# Altium project STM32F746 DEV BOARD_V1I1.PrjPcb (part 2 of 2)

## Sheet [11] - LCD.SchDoc
size A3; DocumentNumber: 11; SheetNumber: 11; SheetTotal: 18
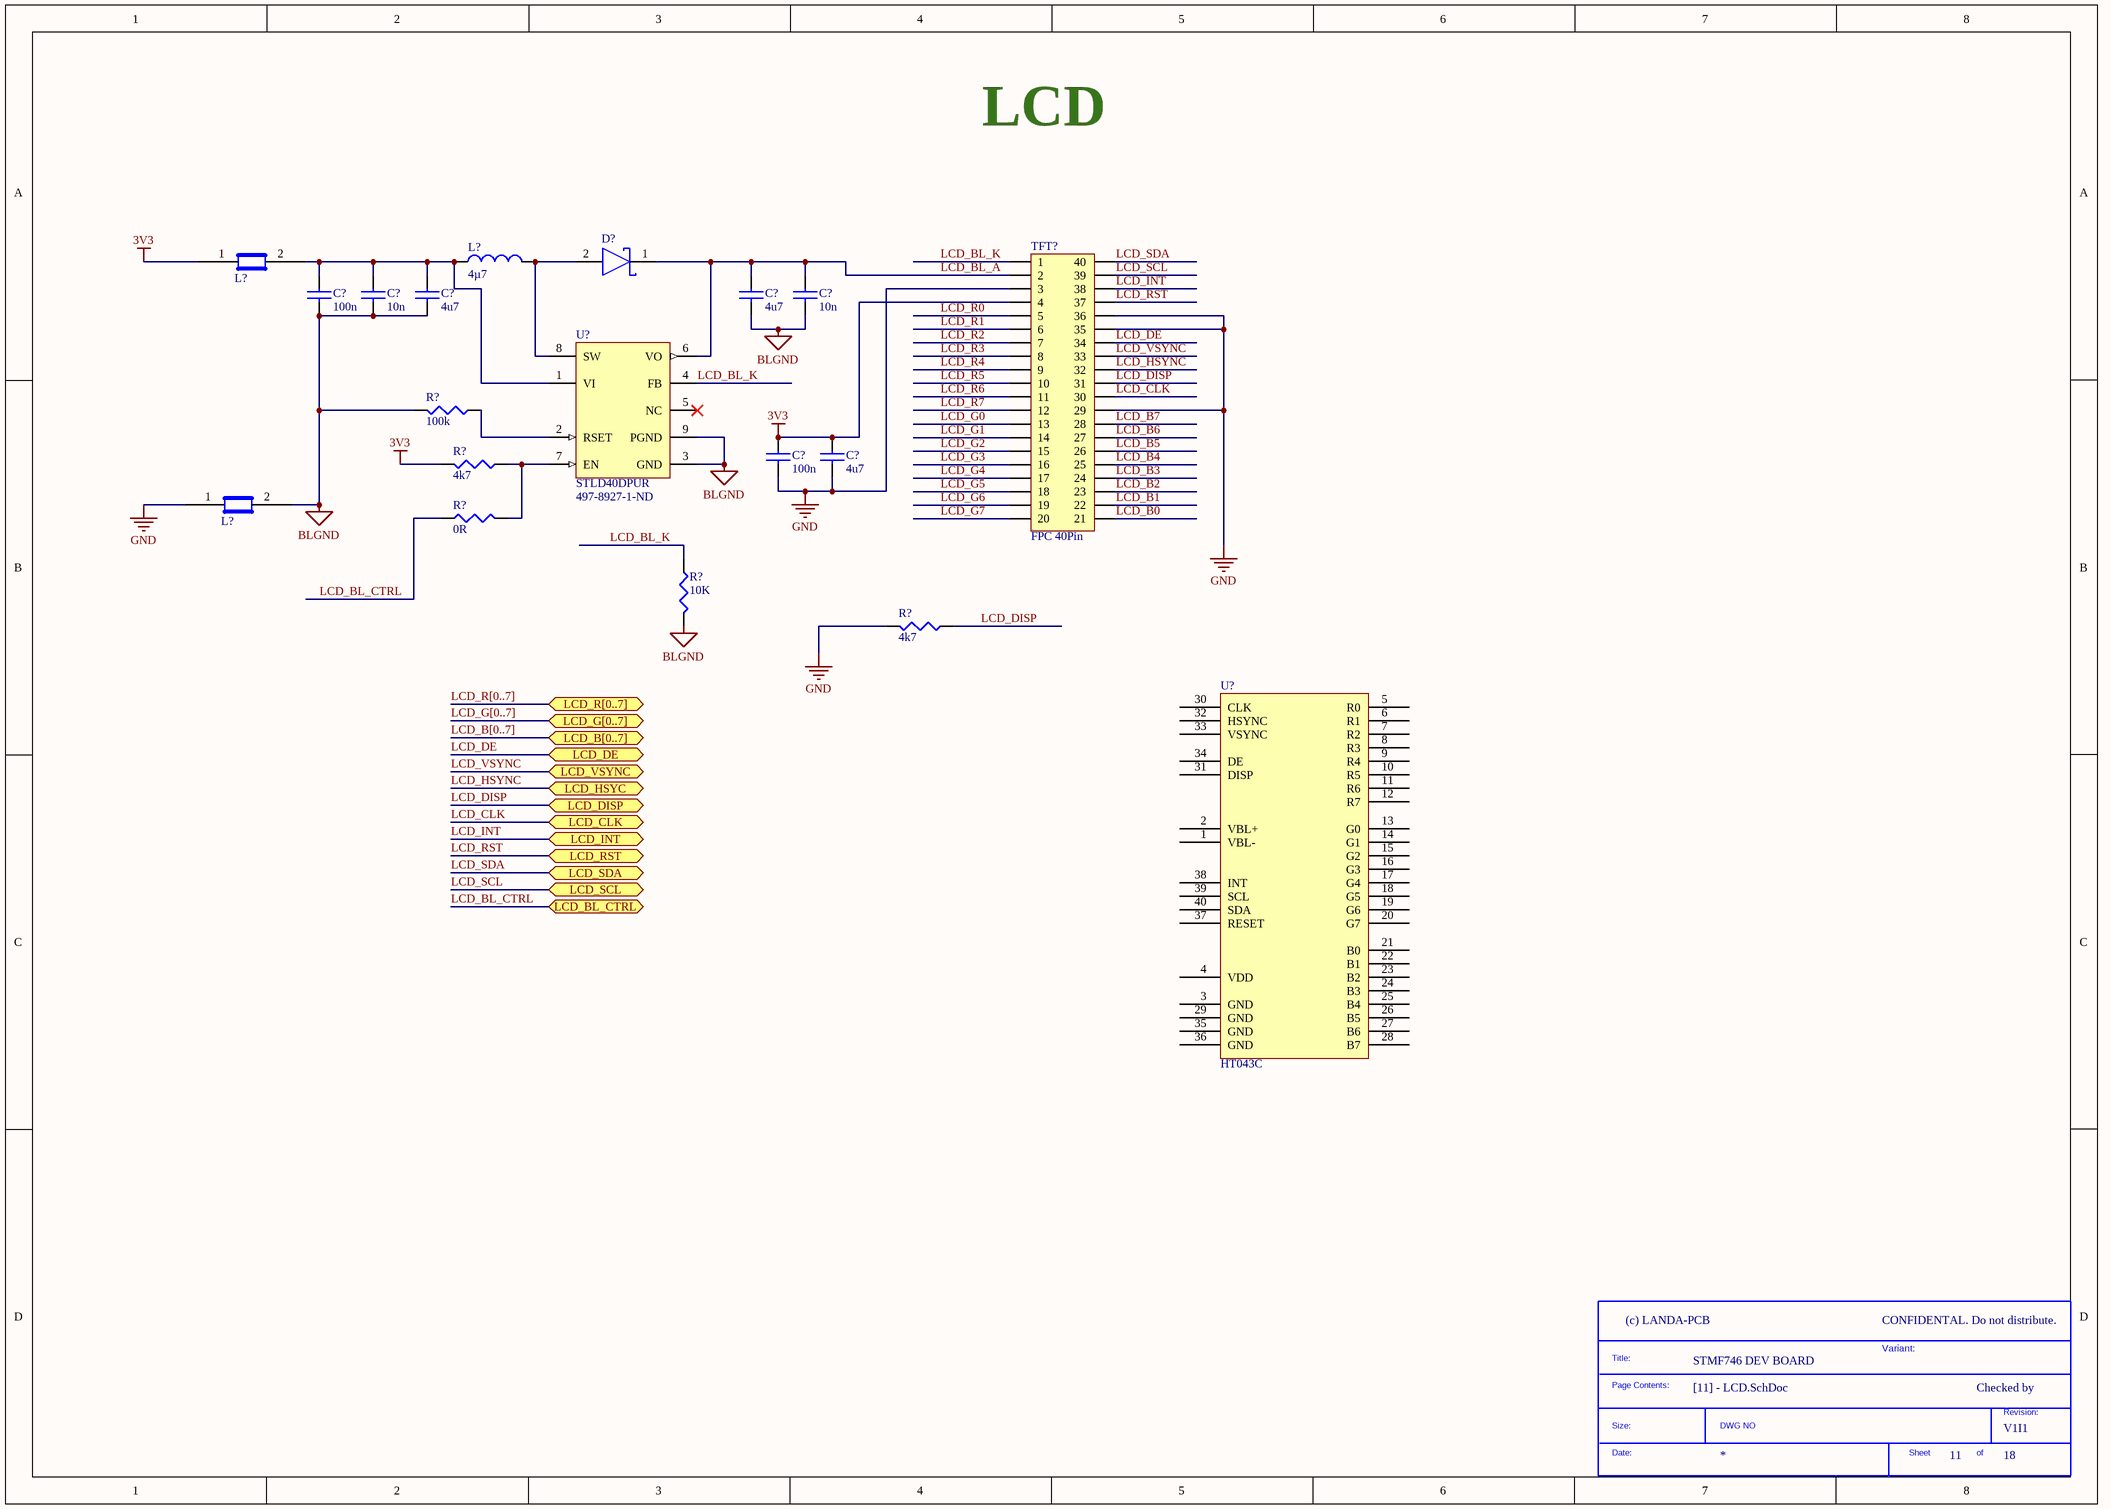
[diagram p13: [11] - LCD.SchDoc]

### Parts
(Parts that share a designator on the sheet are numbered #1, #2 ... from top to bottom, then left to right.)
*#14  SDTitleBlock  (value not drawn)  (graphical)
C?#84  100n  [C0402]
C?#85  10n  [C0402]
C?#86  4u7  [C0402]
C?#87  4u7  [C0402]
C?#88  10n  [C0402]
C?#89  100n  [C0402]
C?#90  4u7  [C0402]
D?#2  STPS1L40M  [STPS1L40M]  (value not drawn)
L?#5  MPZ1608S601A 600OHM/1A  [C0603]  (value not drawn)
L?#6  4µ7  [IHLP_255MILx270MIL]
L?#7  MPZ1608S601A 600OHM/1A  [C0603]  (value not drawn)
R?#98  100k  [R0402]
R?#99  4k7  [R0402]
R?#100  0R  [R0402]
R?#101  10K  [R0402]
R?#102  4k7  [R0402]
TFT?  FPC 40Pin  [FPC_40Pin]
U?#13  STLD40DPUR  Supplier Part Number 1: 497-8927-1-ND  [QFN8_V]
U?#14  HT043C  [LCD_Kunjian_ HT043C_40P_P080_FLEX_FOLDED]

### Ports
LCD_B[0..7] (bidir), LCD_BL_CTRL (bidir), LCD_CLK (bidir), LCD_DE (bidir), LCD_DISP (bidir), LCD_G[0..7] (bidir), LCD_HSYC (bidir), LCD_INT (bidir), LCD_R[0..7] (bidir), LCD_RST (bidir), LCD_SCL (bidir), LCD_SDA (bidir), LCD_VSYNC (bidir)

### Nets
3V3: C?#89.1 C?#90.1 L?#5.1 R?#99.2 TFT?.4  [project net 3V3_uSD]
BLGND: C?#84.2 C?#85.2 C?#86.2 C?#87.2 C?#88.2 L?#7.2 R?#98.2 R?#101.2 U?#13.3(GND) U?#13.9(PGND)
GND: C?#89.2 C?#90.2 L?#7.1 R?#102.2 TFT?.3 TFT?.29 TFT?.35 TFT?.36
LCD_B0: TFT?.21
LCD_B1: TFT?.22
LCD_B2: TFT?.23
LCD_B3: TFT?.24
LCD_B4: TFT?.25
LCD_B5: TFT?.26
LCD_B6: TFT?.27
LCD_B7: TFT?.28
LCD_BL_A: C?#87.1 C?#88.1 D?#2.1(K) TFT?.2 U?#13.6(VO)
LCD_BL_CTRL: R?#100.1 ; port LCD_BL_CTRL
LCD_BL_K: R?#101.1 TFT?.1 U?#13.4(FB)
LCD_CLK: TFT?.30 ; port LCD_CLK
LCD_DE: TFT?.34 ; port LCD_DE
LCD_DISP: R?#102.1 TFT?.31 ; port LCD_DISP
LCD_G0: TFT?.13
LCD_G1: TFT?.14
LCD_G2: TFT?.15
LCD_G3: TFT?.16
LCD_G4: TFT?.17
LCD_G5: TFT?.18
LCD_G6: TFT?.19
LCD_G7: TFT?.20
LCD_HSYNC: TFT?.32 ; port LCD_HSYC
LCD_INT: TFT?.38 ; port LCD_INT
LCD_R0: TFT?.5
LCD_R1: TFT?.6
LCD_R2: TFT?.7
LCD_R3: TFT?.8
LCD_R4: TFT?.9
LCD_R5: TFT?.10
LCD_R6: TFT?.11
LCD_R7: TFT?.12
LCD_RST: TFT?.37 ; port LCD_RST
LCD_SCL: TFT?.39 ; port LCD_SCL
LCD_SDA: TFT?.40 ; port LCD_SDA
LCD_VSYNC: TFT?.33 ; port LCD_VSYNC
NetC?#84_1: C?#84.1 C?#85.1 C?#86.1 L?#5.2 L?#6.1 U?#13.1(VI)
NetD?#2_2: D?#2.2(A) L?#6.2 U?#13.8(SW)
NetR?#98_1: R?#98.1 U?#13.2(RSET)
NetR?#99_1: R?#99.1 R?#100.2 U?#13.7(EN)

Not connected (* = marked no-connect by the designer): U?#13 5(NC)*; U?#14 1(VBL-) 2(VBL+) 3(GND) 4(VDD) 5(R0) 6(R1) 7(R2) 8(R3) 9(R4) 10(R5) 11(R6) 12(R7) 13(G0) 14(G1) 15(G2) 16(G3) 17(G4) 18(G5) 19(G6) 20(G7) 21(B0) 22(B1) 23(B2) 24(B3) 25(B4) 26(B5) 27(B6) 28(B7) 29(GND) 30(CLK) 31(DISP) 32(HSYNC) 33(VSYNC) 34(DE) 35(GND) 36(GND) 37(RESET) 38(INT) 39(SCL) 40(SDA)

### Buses and harness runs
bus LCD_B[0..7] = port LCD_B[0..7]
bus LCD_G[0..7] = port LCD_G[0..7]
bus LCD_R[0..7] = port LCD_R[0..7]

### Notes on the sheet
- LCD
- CONFIDENTAL. Do not distribute.
- CLOCKS (CPU & PCIE)
- Variant:
- Checked by
- (in symbol SDTitleBlock) Title:; Page Contents:; Revision:; Size:; DWG NO; Date:; Sheet; of

### Library data of the parts
C?#84 C?#89 = C1005X5R1H104K: CAP CER .10UF 50V X5R 10% 0402; Manufacturer: TDK Corporation; Capacitance: 0.1µF; Value: 100nF; .Checked PCB: used; Category: Capacitors; Supplier Part Number: 445-5942-1-ND; Manufacturer Part Number: C1005X5R1H104K; Operating Temperature: -55°C ~ 85°C; Package / Case: 0402 (1005 Metric); Price 1k [$]: 0.02340; .Checked SCH: used; Voltage - Rated: 50V; Supplier: Digikey; Supplier 1: Digi-Key; Supplier Part Number 1: 445-5942-1-ND; RoHS: RoHS Compliant; Stock 1: 106926; Pricing 1: 1=0.27, 10=0.18, 100=0.072, 250=0.05176, 500=0.0369, 1000=0.027 (USD); Tolerance: ±10%; Temperature Coefficient: X5R; Mounting Type: Surface Mount, MLCC; Applications: General Purpose; Ratings: -; Size / Dimension: 0.039" L x 0.020" W (1.00mm x 0.50mm); Height - Seated (Max): -; Thickness (Max): 0.022" (0.55mm); Lead Spacing: -; Features: -; Packaging: Cut Tape (CT); Lead Style: -; ComponentLink1URL: http://www.tdk.co.jp/tefe02/e412_c.pdf; ComponentLink1Description: http://www.tdk.co.jp/tefe02/e412_c.pdf
C?#85 C?#88 = C1005X7R1C103K: CAP CER 10000PF 16V X7R 10% 0402; Manufacturer: TDK Corporation; Value: 10nF; .Checked PCB: used; Capacitance: 10000pF; Category: Capacitors; Manufacturer Part Number: C1005X7R1C103K; Operating Temperature: -55°C ~ 125°C; Package / Case: 0402 (1005 Metric); Price 1k [$]: 0.00416; .Checked SCH: used; Voltage - Rated: 16V; Supplier Part Number: 445-1262-1-ND; Supplier: Digikey; Supplier 1: Digi-Key; Supplier Part Number 1: 445-1262-1-ND; RoHS: RoHS Compliant; Stock 1: 511497; Pricing 1: 1=0.08, 10=0.05, 100=0.018, 250=0.013, 500=0.0096, 1000=0.0065 (USD); Tolerance: ±10%; Temperature Coefficient: X7R; Mounting Type: Surface Mount, MLCC; Applications: General Purpose; Ratings: -; Size / Dimension: 0.039" L x 0.020" W (1.00mm x 0.50mm); Height - Seated (Max): -; Thickness (Max): 0.022" (0.55mm); Lead Spacing: -; Features: -; Packaging: Cut Tape (CT); Lead Style: -; ComponentLink1URL: http://www.tdk.co.jp/tefe02/e412_c.pdf; ComponentLink1Description: http://www.tdk.co.jp/tefe02/e412_c.pdf
C?#86 C?#87 C?#90 = C1005X5R1A475M: CAP CER 4.7UF 10V 20% X5R 0402; Manufacturer: TDK Corporation; Capacitance: 4.7µF; .Checked PCB: RF; Supplier 1: Digi-Key; Supplier Part Number 1: 445-8023-1-ND; Manufacturer Part Number: C1005X5R1A475M; RoHS: RoHS Compliant; Category: Capacitors; Stock 1: 10140; Pricing 1: 1=0.53, 10=0.415, 100=0.25, 250=0.18752, 500=0.16, 1000=0.125, 5000=0.095 (USD); Voltage - Rated: 10V; Tolerance: ±20%; Temperature Coefficient: X5R; Mounting Type: Surface Mount, MLCC; Operating Temperature: -55°C ~ 85°C; Applications: General Purpose; Ratings: -; Package / Case: 0402 (1005 Metric); Size / Dimension: 0.039" L x 0.020" W (1.00mm x 0.50mm); Height - Seated (Max): -; Thickness (Max): -; Lead Spacing: -; Features: -; Packaging: Cut Tape (CT); Lead Style: -; ComponentLink1URL: http://www.tdk.com/pdf/general_B11.pdf; ComponentLink1Description: http://www.tdk.com/pdf/general_B11.pdf; .Checked SCH: RF
L?#5 L?#7 = MPZ1608S601A: FERRITE CHIP BEAD 600 OHM SMD 1A; Manufacturer: TDK Corporation; Impedance @ Frequency: 600 Ohm @ 100MHz; DC Resistance (DCR): 150 mOhm Max; Filter Type: Differential Mode - Single; Number of Lines: 1; .Checked PCB: RF; Supplier 1: Digi-Key; Supplier Part Number 1: 445-2205-1-ND; Manufacturer Part Number: MPZ1608S601A; RoHS: RoHS Compliant; Category: Filters; Stock 1: 328345; Pricing 1: 1=0.36, 10=0.24, 100=0.096, 250=0.069, 500=0.0492, 1000=0.036 (USD); Current Rating: 1A; Package / Case: 0603 (1608 Metric); Mounting Type: Surface Mount; Packaging: Cut Tape (CT); Height (Max): 0.037" (0.95mm); Size / Dimension: 0.063" L x 0.031" W (1.60mm x 0.80mm); ComponentLink1URL: http://www.tdk.co.jp/tefe02/e9413_mpz.pdf; ComponentLink1Description: http://www.tdk.co.jp/tefe02/e9413_mpz.pdf; .Checked SCH: RF
L?#6 = IHLP2525CZER4R7M01: INDUCTOR POWER 4.7UH 5.5A SMD; Manufacturer: Vishay/Dale; .Checked PCB: used; Inductance: 4.7µH; Current - Saturation: 10A; Shielding: Shielded; DC Resistance (DCR): 40 mOhm Max; Tolerance: ±20%; Frequency - Test: 100kHz; .Checked SCH: used; Category: Inductors, Coils, Chokes; Manufacturer Part Number: IHLP2525CZER4R7M01; Operating Temperature: -55°C ~ 125°C; Package / Case: 0.270" L x 0.255" W x 0.118" H (6.86mm x 6.47mm x 3.00mm); Price 1k [$]: 1.09800; Value: 4µ7; Current: 5.5A; Applications: General Purpose; Supplier Part Number: 541-1010-1-ND; Supplier: Digikey; Supplier 1: Digi-Key; Supplier Part Number 1: 541-1010-1-ND; RoHS: RoHS Compliant; Stock 1: 25684; Pricing 1: 1=2.26, 10=1.83, 100=1.525, 500=1.22, 1000=1.098 (USD); Current - Temperature Rise: 5.5A; Type: -; Q @ Freq: -; Frequency - Self Resonant: -; Material - Core: -; Mounting Type: Surface Mount; Packaging: Cut Tape (CT); ComponentLink1URL: http://www.vishay.com/doc?34104; ComponentLink1Description: http://www.vishay.com/doc?34104
R?#98 R?#99 R?#102 = RC0402FR-0710KL: RES 10.0K OHM 1/16W 1% 0402 SMD; Manufacturer: Yageo; Resistance (Ohms): 10K; Power (Watts): 0.063W, 1/16W; Value: 10k; .Checked PCB: used; Temperature Coefficient: ±100ppm/°C; Category: Resistors; Supplier Part Number: 311-10.0KLRCT-ND; Manufacturer Part Number: RC0402FR-0710KL; Package / Case: 0402 (1005 Metric); Price 1k [$]: 0.01421; Tolerance: ±1%; .Checked SCH: used; Supplier: Digikey; Supplier 1: Digi-Key; Supplier Part Number 1: 311-10.0KLRCT-ND; RoHS: RoHS Compliant; Stock 1: 2916495; Pricing 1: 10=0.014, 50=0.0104, 100=0.0079, 250=0.00584, 500=0.00432, 1000=0.00288 (USD); Composition: Thick Film; Features: -; Size / Dimension: 0.039" L x 0.020" W (1.00mm x 0.50mm); Height: 0.016" (0.40mm); Number of Terminations: 2; Packaging: Cut Tape (CT); ComponentLink1URL: http://www.yageo.com/documents/recent/PYu-RC0402_51_RoHS_L_6.pdf; ComponentLink1Description: http://www.yageo.com/documents/recent/PYu-RC0402_51_RoHS_L_6.pdf
R?#100 = CRCW0402330RFKED: RES 330 OHM 1/16W 1% 0402 SMD; Manufacturer: Vishay Dale; Resistance (Ohms): 330; Power (Watts): 0.063W, 1/16W; Temperature Coefficient: ±100ppm/°C; .Checked PCB: RF; Supplier 1: Digi-Key; Supplier Part Number 1: 541-330LCT-ND; Manufacturer Part Number: CRCW0402330RFKED; RoHS: RoHS Compliant; Category: Resistors; Stock 1: 49303; Pricing 1: 10=0.083, 50=0.0444, 200=0.0255, 1000=0.0174 (USD); Composition: Thick Film; Features: -; Tolerance: ±1%; Package / Case: 0402 (1005 Metric); Size / Dimension: 0.039" L x 0.020" W (1.00mm x 0.50mm); Height: 0.016" (0.40mm); Number of Terminations: 2; Packaging: Cut Tape (CT); ComponentLink1URL: http://www.vishay.com/doc?20035; ComponentLink1Description: http://www.vishay.com/doc?20035; .Checked SCH: RF
R?#101 = RC0402FR-07100RL: RES 100 OHM 1/16W 1% 0402 SMD; Manufacturer: Yageo; Resistance (Ohms): 100; Power (Watts): 0.063W, 1/16W; Value: 100R; .Checked PCB: RF; Temperature Coefficient: ±100ppm/°C; Category: Resistors; Supplier Part Number: 311-100LRCT-ND; Manufacturer Part Number: RC0402FR-07100RL; Package / Case: 0402 (1005 Metric); Price 1k [$]: 0.01421; Tolerance: ±1%; .Checked SCH: RF; Supplier: Digikey; Supplier 1: Digi-Key; Supplier Part Number 1: 311-100LRCT-ND; RoHS: RoHS Compliant; Stock 1: 1682040; Pricing 1: 10=0.014, 50=0.0104, 100=0.0079, 250=0.00584, 500=0.00432, 1000=0.00288 (USD); Composition: Thick Film; Features: -; Size / Dimension: 0.039" L x 0.020" W (1.00mm x 0.50mm); Height: 0.016" (0.40mm); Number of Terminations: 2; Packaging: Cut Tape (CT); ComponentLink1URL: http://www.yageo.com/documents/recent/PYu-RC0402_51_RoHS_L_6.pdf; ComponentLink1Description: http://www.yageo.com/documents/recent/PYu-RC0402_51_RoHS_L_6.pdf
TFT? = FPC_40Pin: DISIGNER: ARMAN ARVAND
U?#13 = STLD40DPUR: White Led Power Supply For Large Display Backlight, 8-Pin VFDFPN, Tape and Reel; ComponentLink1Description: Manufacturer URL; ComponentLink2Description: Datasheet; DatasheetVersion: May-2011; ComponentLink1URL: http://www.st.com; PackageVersion: 2011; PackageDescription: 8-Pin Dual Flat No-Lead, 3 x 3 mm Body, 0.65 mm Pitch, Exposed Pad; ComponentLink2URL: http://www.st.com/internet/com/TECHNICAL_RESOURCES/TECHNICAL_LITERATURE/DATASHEET/CD00098098.pdf; PackageReference: QFN8; PartNumber: STLD40DPUR; Supplier 1: Digi-Key
U?#14 = HT043C: 4.3 inch TFT 480*272 pixels with LED Backlight and Capacitive touch panel, high luminance; Manuf_1: KUNJIAN; ECCN_US/EU: EAR99/NEC; Manuf_Part_1: HT043C; Distrib: Sub Co; Ref St: *
D?#2 = STPS1L40M: Supplier 1: Digi-Key; Supplier Part Number 1: 497-3212-1-ND

## Sheet [12] - CAN.SchDoc
size A3; DocumentNumber: 12; SheetNumber: 12; SheetTotal: 18
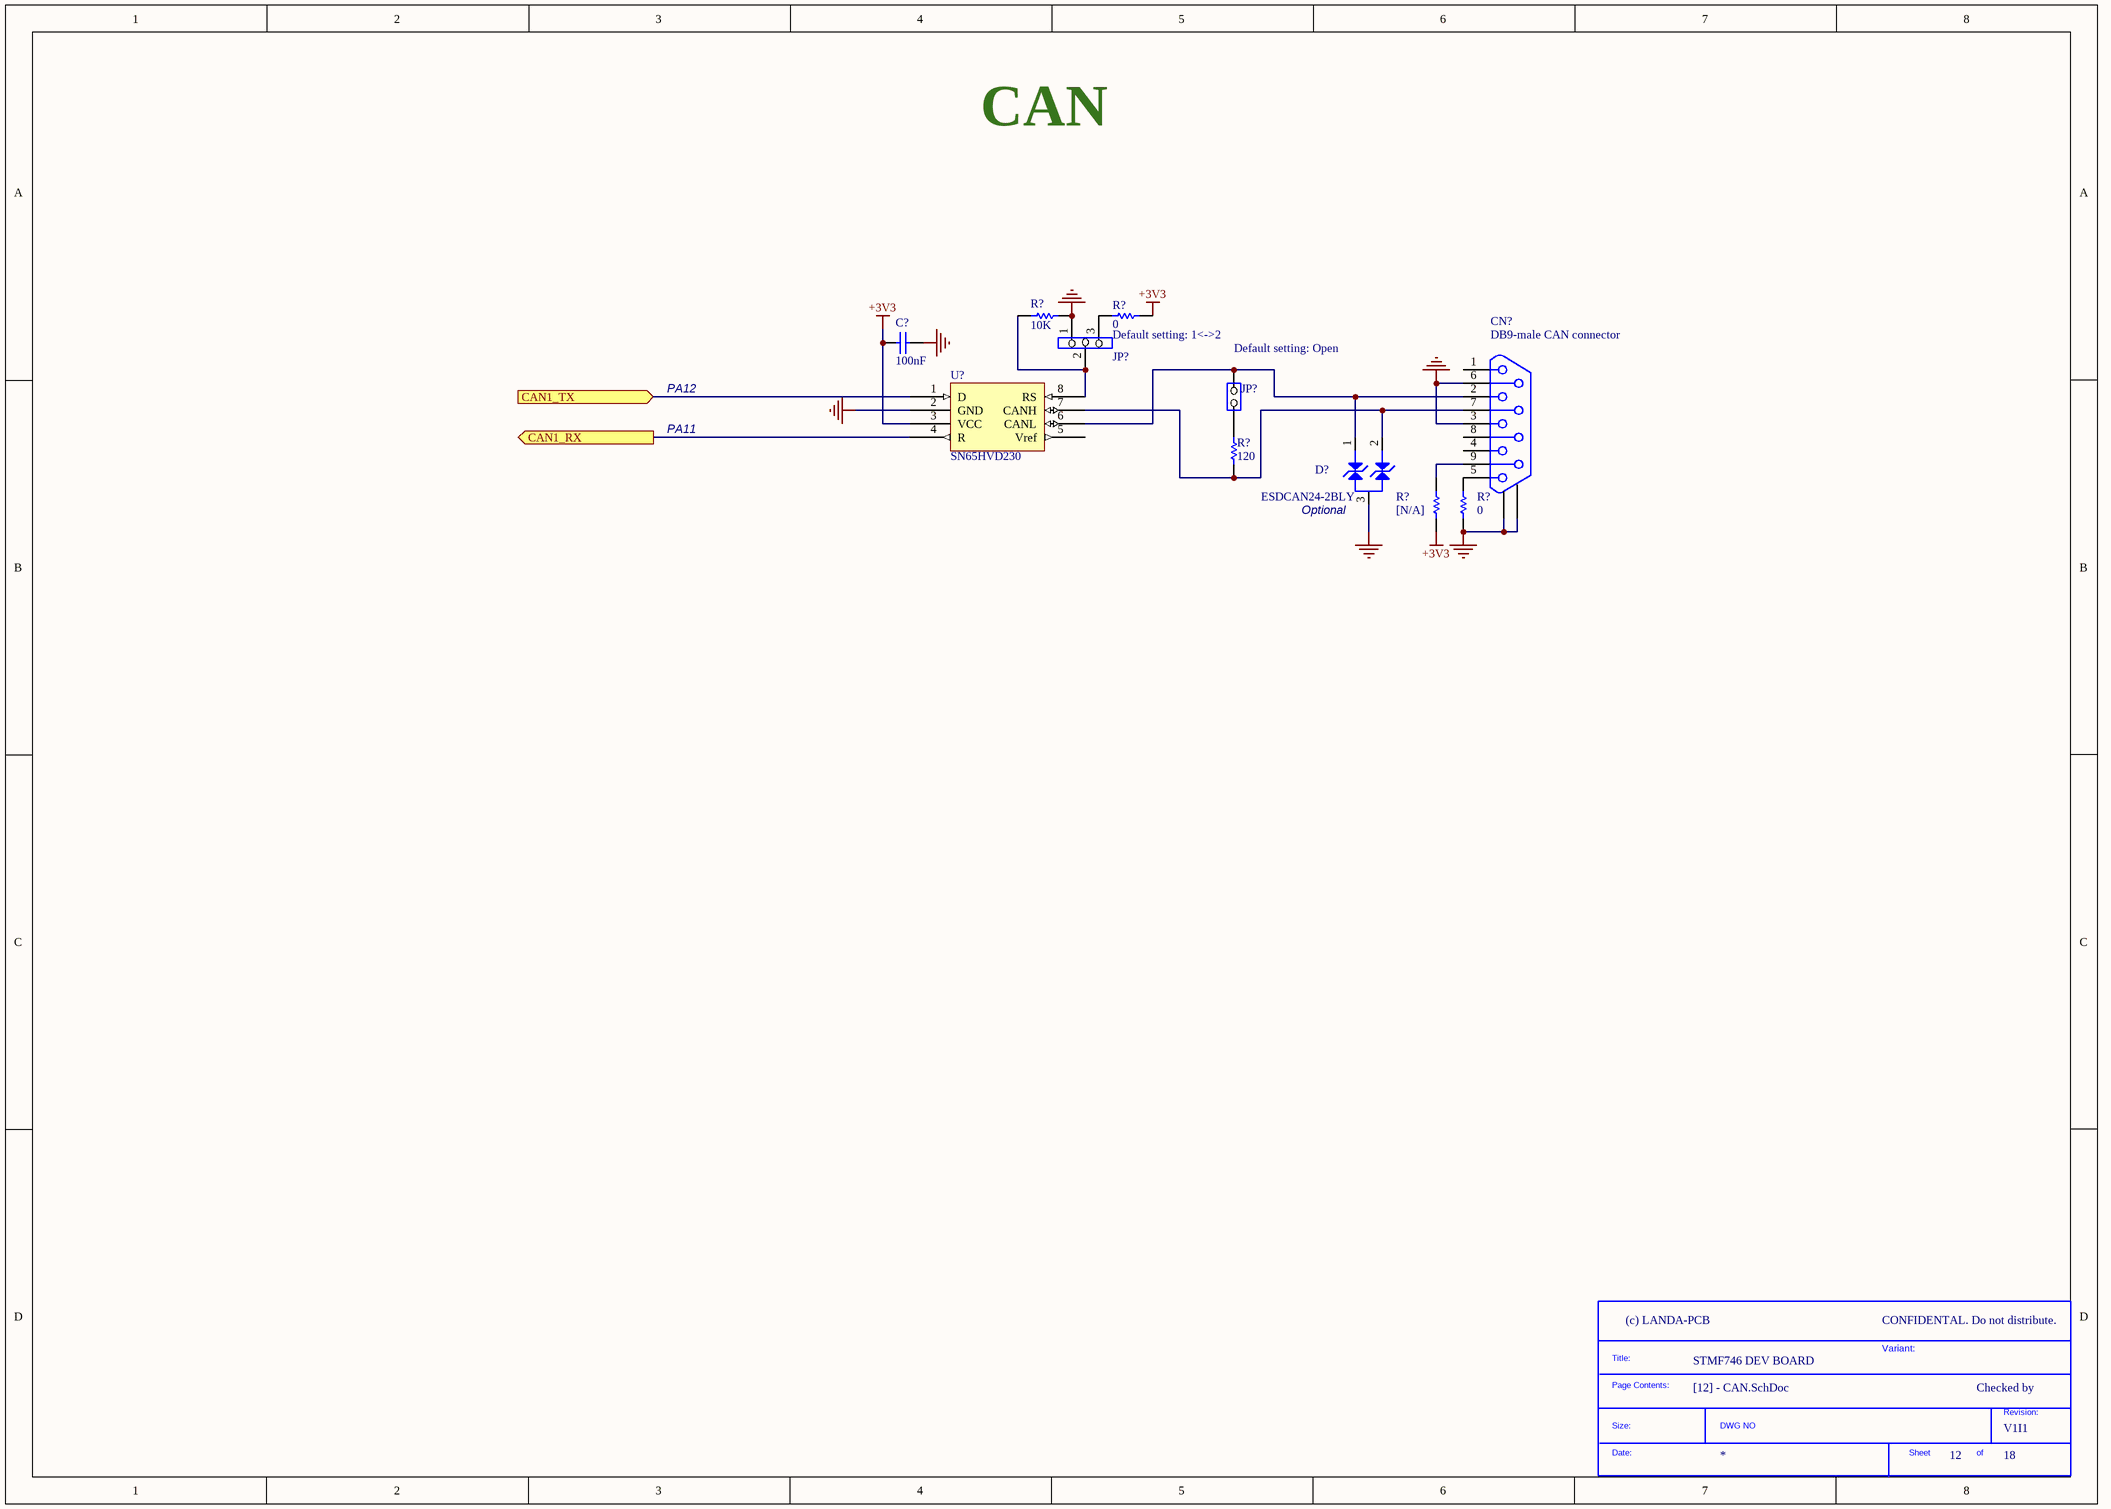
[diagram p14: [12] - CAN.SchDoc]

### Parts
(Parts that share a designator on the sheet are numbered #1, #2 ... from top to bottom, then left to right.)
*#15  SDTitleBlock  (value not drawn)  (graphical)
C?#91  100nF  [0603C]
CN?#8  DB9-male CAN connector  [DB9/M]
D?#3  ESDCAN24-2BLY  [SOT-23]
JP?#2  (no value)  [SIP3]
JP?#3  (no value)  [SIP2]
R?#103  10K  [0603R]
R?#104  0  [0603R]
R?#105  120  [0603R]
R?#106  [N/A]  [0603R]
R?#107  0  [0603R]
U?#15  SN65HVD230  [SOIC8_1R27_4R9X6]

### Ports
CAN1_RX (out), CAN1_TX (in)

### Nets
+3V3: C?#91.1 R?#104.2 R?#106.1 U?#15.3(VCC)
GND: C?#91.2 CN?#8.3 CN?#8.6 CN?#8.10 CN?#8.11 D?#3.3 JP?#2.1 R?#103.2 R?#107.1 U?#15.2(GND)
NetCN?#8_2: CN?#8.2 D?#3.1 JP?#3.2(NO) U?#15.6(CANL)
NetCN?#8_5: CN?#8.5 R?#107.2
NetCN?#8_7: CN?#8.7 D?#3.2 R?#105.1 U?#15.7(CANH)
NetCN?#8_9: CN?#8.9 R?#106.2
NetJP?#2_2: JP?#2.2 R?#103.1 U?#15.8(RS)
NetJP?#2_3: JP?#2.3 R?#104.1
NetJP?#3_1: JP?#3.1(COMMON) R?#105.2
NetU?#15_1: U?#15.1(D) ; port CAN1_TX
NetU?#15_4: U?#15.4(R) ; port CAN1_RX

Not connected (* = marked no-connect by the designer): CN?#8 1 4 8; U?#15 5(Vref)

### Notes on the sheet
- CAN
- Default setting: 1<->2
- (near JP?#3) Default setting: Open
- PA12
- PA11
- (near D?#3) Optional
- CONFIDENTAL. Do not distribute.
- CLOCKS (CPU & PCIE)
- Variant:
- Checked by
- (in symbol SDTitleBlock) Title:; Page Contents:; Revision:; Size:; DWG NO; Date:; Sheet; of

### Library data of the parts
C?#91 = Cap: Capacitor; Value: 10nF; Published: 8-Jun-2000; Revision: July-2002: Re-released for DXP Platform.; Publisher: Altium Limited
CN?#8 = DB9-CAN
JP?#2 = Jumper3
JP?#3 = JP2
R?#103 = Res1: Resistor; Value: 1K; Published: 8-Jun-2000; Revision: July-2002: Re-released for DXP Platform.; Publisher: Altium Limited
R?#104-R?#107 = res1: Resistor; Value: 1K; Published: 8-Jun-2000; Revision: July-2002: Re-released for DXP Platform.; Publisher: Altium Limited
U?#15 = SN65HVD230D

## Sheet [13] - AUDIO.SchDoc
size A3; DocumentNumber: 13; SheetNumber: 13; SheetTotal: 18
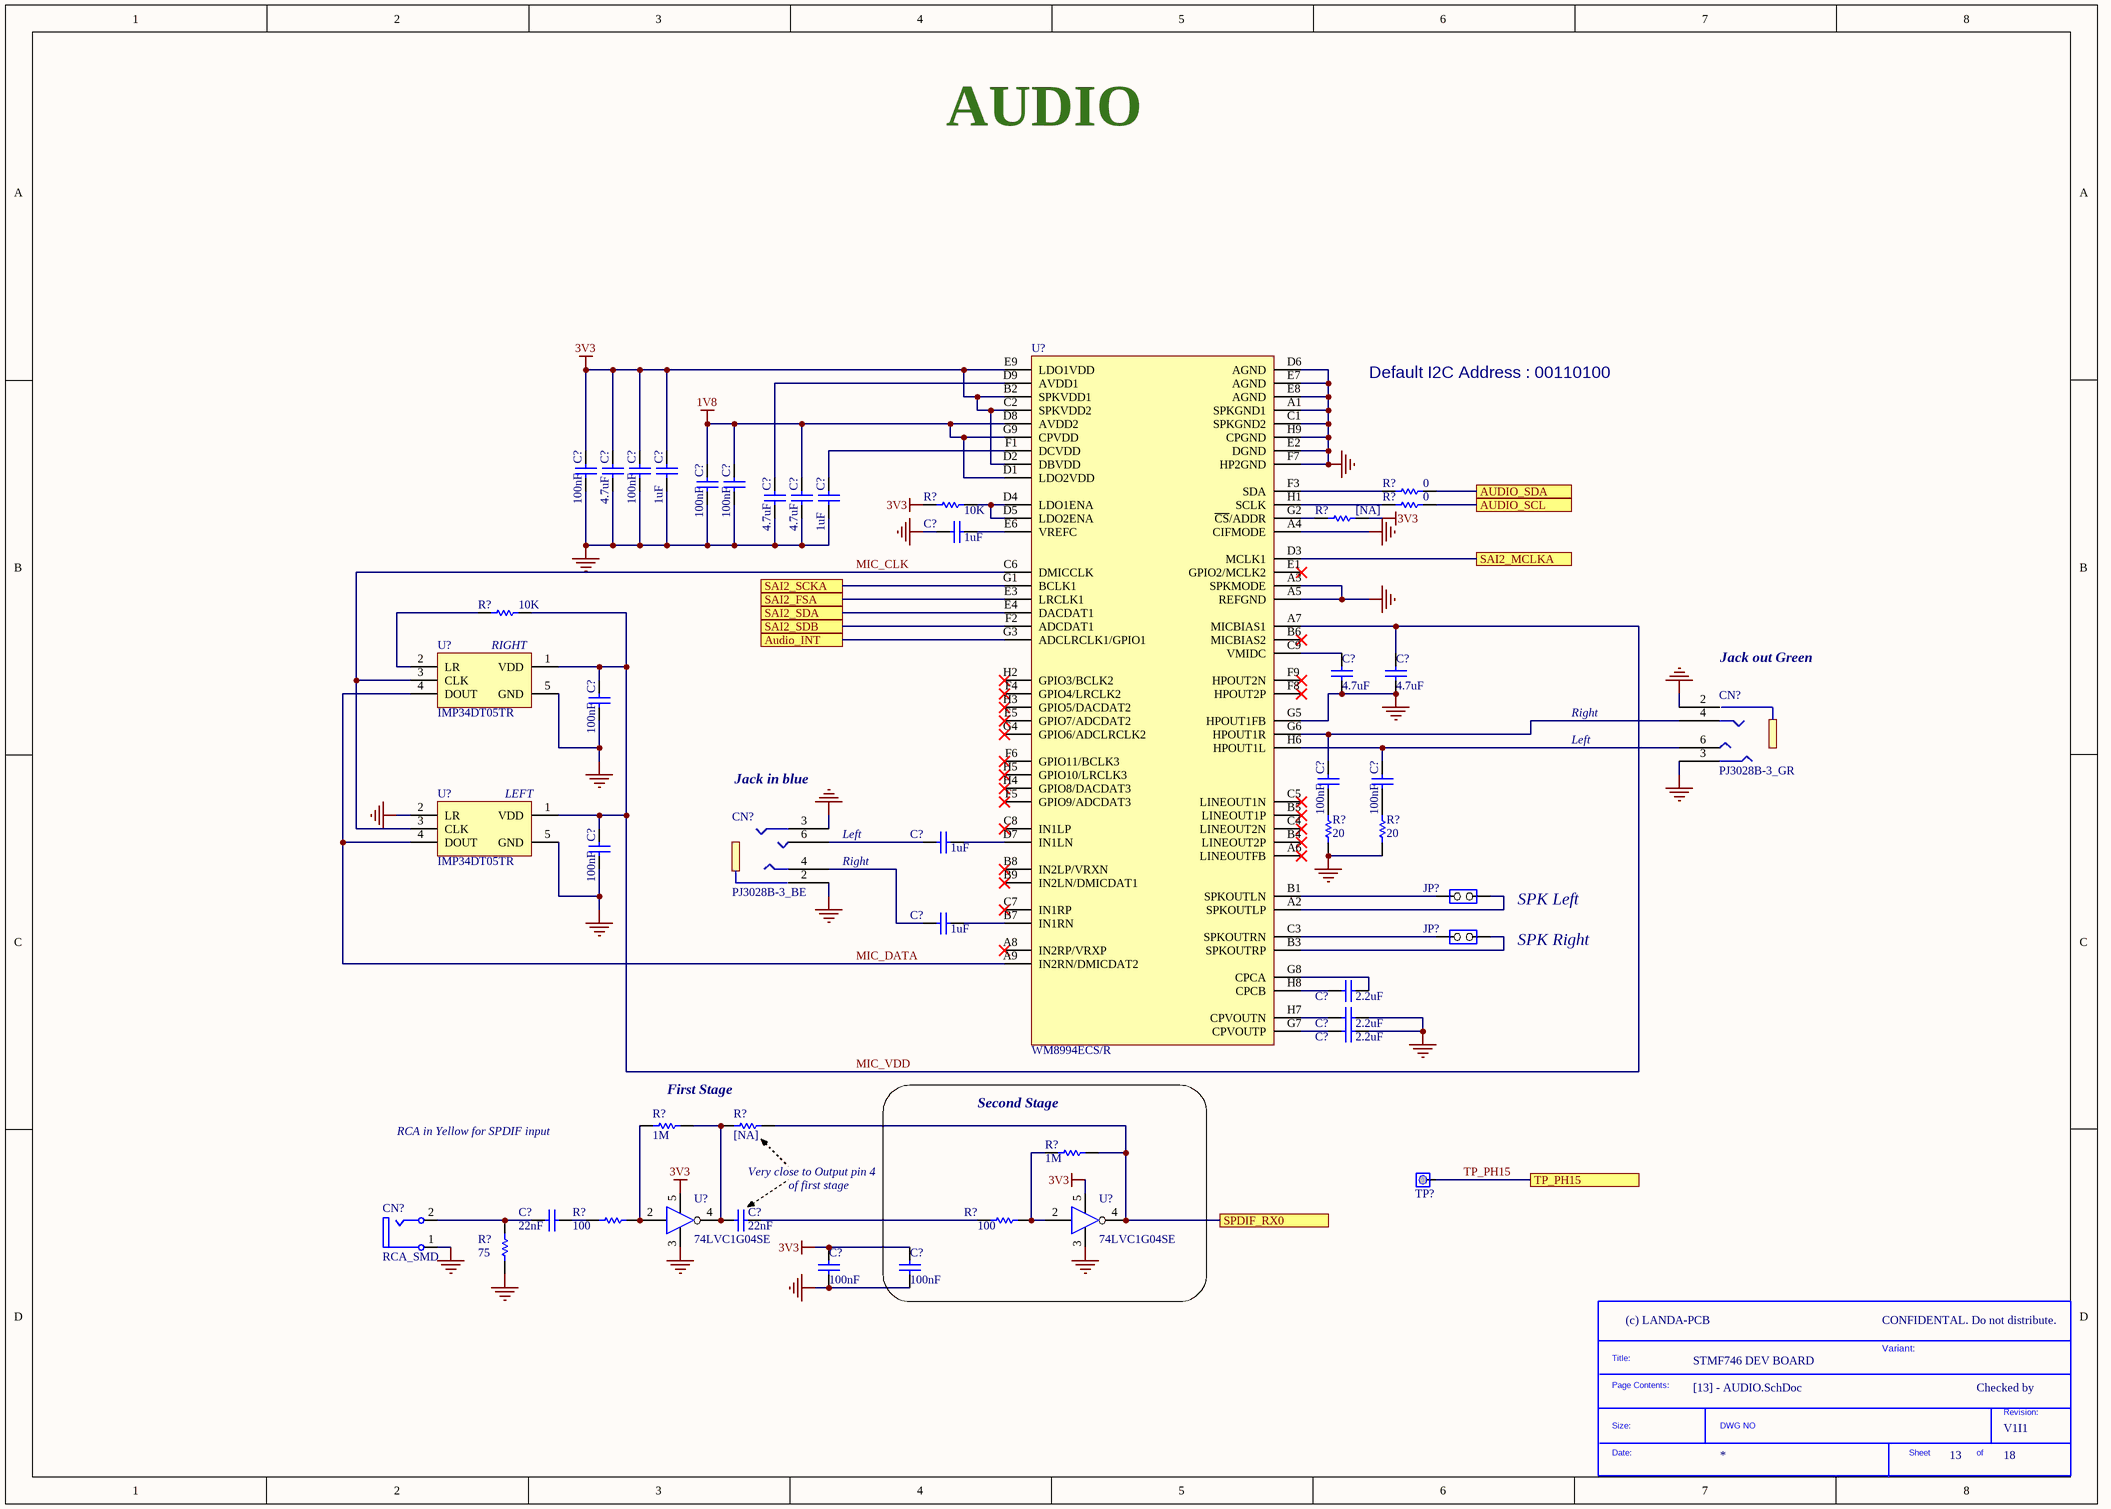
[diagram p15: [13] - AUDIO.SchDoc]

### Parts
(Parts that share a designator on the sheet are numbered #1, #2 ... from top to bottom, then left to right.)
*#16  SDTitleBlock  (value not drawn)  (graphical)
C?#92  100nF  [0402C]
C?#93  4.7uF  [0603C]
C?#94  100nF  [0402C]
C?#95  1uF  [0603C]
C?#96  100nF  [0402C]
C?#97  100nF  [0402C]
C?#98  4.7uF  [0603C]
C?#99  4.7uF  [0603C]
C?#100  1uF  [0603C]
C?#101  1uF  [0603C]
C?#102  4.7uF  [0603C]
C?#103  4.7uF  [0603C]
C?#104  100nF  [0402C]
C?#105  100nF  [0402C]
C?#106  100nF  [0402C]
C?#107  100nF  [0402C]
C?#108  1uF  [0603C]
C?#109  1uF  [0603C]
C?#110  2.2uF  [0603C]
C?#111  2.2uF  [0603C]
C?#112  2.2uF  [0603C]
C?#113  22nF  [0402C]
C?#114  22nF  [0402C]
C?#115  100nF  [0402C]
C?#116  100nF  [0402C]
CN?#9  PJ3028B-3_GR  [PJ3028B]
CN?#10  PJ3028B-3_BE  [PJ3028B]
CN?#11  RCA_SMD  [RCA_SMD]
JP?#4  Jumper 2 pins  [SIP2/2.54]  (value not drawn)
JP?#5  Jumper 2 pins  [SIP2/2.54]  (value not drawn)
R?#108  [NA]  [0402R]
R?#109  0  [0402R]
R?#110  10K  [0402R]
R?#111  0  [0402R]
R?#112  10K  [0402R]
R?#113  20  [0402R]
R?#114  20  [0402R]
R?#115  1M  [0402R]
R?#116  [NA]  [0402R]
R?#117  1M  [0402R]
R?#118  100  [0402R]
R?#119  100  [0402R]
R?#120  75  [0402R]
TP?#3  Test point 1 pin with hole  [SIP1/2.54]  (value not drawn)
U?#16  WM8994ECS/R  [BGA72_0R5_4R5X4]
U?#17  IMP34DT05TR  [HCLGA_3X4X1_4LD]
U?#18  IMP34DT05TR  [HCLGA_3X4X1_4LD]
U?#19  74LVC1G04SE  [SOT353]
U?#20  74LVC1G04SE  [SOT353]

### Blocks framed on the sheet
Second Stage: C?#116 R?#117 R?#119 U?#20

### Ports
Audio_INT, AUDIO_SCL, AUDIO_SDA, SAI2_FSA, SAI2_MCLKA, SAI2_SCKA, SAI2_SDA, SAI2_SDB, SPDIF_RX0, TP_PH15

### Nets
1V8: C?#96.1 C?#97.1 C?#99.1 U?#16.D1(LDO2VDD) U?#16.D8(AVDD2) U?#16.G9(CPVDD)
3V3: C?#92.1 C?#93.1 C?#94.1 C?#95.2 C?#115.2 C?#116.2 R?#108.2 R?#110.2 U?#16.B2(SPKVDD1) U?#16.C2(SPKVDD2) U?#16.D2(DBVDD) U?#16.E9(LDO1VDD) U?#19.5(VCC) U?#20.5(VCC)  [project net 3V3_uSD]
GND: C?#92.2 C?#93.2 C?#94.2 C?#95.1 C?#96.2 C?#97.2 C?#98.2 C?#99.2 C?#100.1 C?#101.2 C?#102.1 C?#103.1 C?#104.2 C?#107.2 C?#111.2 C?#112.2 C?#115.1 C?#116.1 CN?#9.2 CN?#9.3 CN?#10.2 CN?#10.3 CN?#11.1(Ground) R?#113.2 R?#114.2 R?#120.1 U?#16.A1(SPKGND1) U?#16.A3(SPKMODE) U?#16.A4(CIFMODE) U?#16.A5(REFGND) U?#16.C1(SPKGND2) U?#16.D6(AGND) U?#16.E2(DGND) U?#16.E7(AGND) U?#16.E8(AGND) U?#16.F7(HP2GND) U?#16.G5(HPOUT1FB) U?#16.H9(CPGND) U?#17.5(GND) U?#18.2(LR) U?#18.5(GND) U?#19.3(GND) U?#20.3(GND)
MIC_CLK: U?#16.C6(DMICCLK) U?#17.3(CLK) U?#18.3(CLK)
MIC_DATA: U?#16.A9(IN2RN/DMICDAT2) U?#17.4(DOUT) U?#18.4(DOUT)
MIC_VDD: C?#103.2 C?#104.1 C?#107.1 R?#112.2 U?#16.A7(MICBIAS1) U?#17.1(VDD) U?#18.1(VDD)
TP_PH15: TP?#3.1(COMMON) ; port TP_PH15
NetC?#98_1: C?#98.1 U?#16.D9(AVDD1)
NetC?#100_2: C?#100.2 U?#16.F1(DCVDD)
NetC?#101_1: C?#101.1 U?#16.E6(VREFC)
NetC?#102_2: C?#102.2 U?#16.C9(VMIDC)
NetC?#105_1: C?#105.1 CN?#9.4 U?#16.G6(HPOUT1R)
NetC?#105_2: C?#105.2 R?#113.1
NetC?#106_1: C?#106.1 CN?#9.6 U?#16.H6(HPOUT1L)
NetC?#106_2: C?#106.2 R?#114.1
NetC?#108_1: C?#108.1 U?#16.D7(IN1LN)
NetC?#108_2: C?#108.2 CN?#10.6
NetC?#109_1: C?#109.1 U?#16.B7(IN1RN)
NetC?#109_2: C?#109.2 CN?#10.4
NetC?#110_1: C?#110.1 U?#16.H8(CPCB)
NetC?#110_2: C?#110.2 U?#16.G8(CPCA)
NetC?#111_1: C?#111.1 U?#16.H7(CPVOUTN)
NetC?#112_1: C?#112.1 U?#16.G7(CPVOUTP)
NetC?#113_1: C?#113.1 CN?#11.2(Signal) R?#120.2
NetC?#113_2: C?#113.2 R?#118.1
NetC?#114_1: C?#114.1 R?#115.2 R?#116.1 U?#19.4(Y)
NetC?#114_2: C?#114.2 R?#119.1
NetJP?#4_1: JP?#4.1(COMMON) U?#16.B1(SPKOUTLN)
NetJP?#4_2: JP?#4.2(NO) U?#16.A2(SPKOUTLP)
NetJP?#5_1: JP?#5.1(COMMON) U?#16.C3(SPKOUTRN)
NetJP?#5_2: JP?#5.2(NO) U?#16.B3(SPKOUTRP)
NetR?#108_1: R?#108.1 U?#16.G2(~{CS}/ADDR)
NetR?#109_1: R?#109.1 ; port AUDIO_SDA
NetR?#109_2: R?#109.2 U?#16.F3(SDA)
NetR?#110_1: R?#110.1 U?#16.D4(LDO1ENA) U?#16.D5(LDO2ENA)
NetR?#111_1: R?#111.1 ; port AUDIO_SCL
NetR?#111_2: R?#111.2 U?#16.H1(SCLK)
NetR?#112_1: R?#112.1 U?#17.2(LR)
NetR?#115_1: R?#115.1 R?#118.2 U?#19.2(A)
NetR?#116_2: R?#116.2 R?#117.2 U?#20.4(Y) ; port SPDIF_RX0
NetR?#117_1: R?#117.1 R?#119.2 U?#20.2(A)
NetU?#16_D3: U?#16.D3(MCLK1) ; port SAI2_MCLKA
NetU?#16_E3: U?#16.E3(LRCLK1) ; port SAI2_FSA
NetU?#16_E4: U?#16.E4(DACDAT1) ; port SAI2_SDA
NetU?#16_F2: U?#16.F2(ADCDAT1) ; port SAI2_SDB
NetU?#16_G1: U?#16.G1(BCLK1) ; port SAI2_SCKA
NetU?#16_G3: U?#16.G3(ADCLRCLK1/GPIO1) ; port Audio_INT

Not connected (* = marked no-connect by the designer): U?#16 A6(LINEOUTFB)* A8(IN2RP/VRXP)* B4(LINEOUT2P)* B5(LINEOUT1P)* B6(MICBIAS2)* B8(IN2LP/VRXN)* B9(IN2LN/DMICDAT1)* C4(LINEOUT2N)* C5(LINEOUT1N)* C7(IN1RP)* C8(IN1LP)* E1(GPIO2/MCLK2)* E5(GPIO7/ADCDAT2)* F4(GPIO4/LRCLK2)* F5(GPIO9/ADCDAT3)* F6(GPIO11/BCLK3)* F8(HPOUT2P)* F9(HPOUT2N)* G4(GPIO6/ADCLRCLK2)* H2(GPIO3/BCLK2)* H3(GPIO5/DACDAT2)* H4(GPIO8/DACDAT3)* H5(GPIO10/LRCLK3)*; U?#19 1(NC); U?#20 1(NC)

### Notes on the sheet
- AUDIO
- Default I2C Address : 00110100
- (near U?#17) RIGHT
- Right
- (near CN?#9) Jack out Green
- (near CN?#10) Jack in blue
- Left
- (near U?#18) LEFT
- (near JP?#4) SPK Left
- (near JP?#5) SPK Right
- (near R?#115) First Stage
- RCA in Yellow for SPDIF input
- Very close to Output pin 4
- of first stage
- CONFIDENTAL. Do not distribute.
- CLOCKS (CPU & PCIE)
- Variant:
- Checked by
- (in symbol SDTitleBlock) Title:; Page Contents:; Revision:; Size:; DWG NO; Date:; Sheet; of

### Library data of the parts
C?#92 C?#94 C?#96 C?#97 C?#104-C?#107 C?#115 C?#116 = Cap_100nF_X7R_10%_0402: Capacitor,100nF,16V,X7R,10%,0402,YAGEO; Manuf_Part_1: CC0402KRX7R7BB104; Revision: July-2002: Re-released for DXP Platform.; Value: 100nF; Order: CC0402KRX7R7BB104; Manuf_1: YAGEO
  C?#92 C?#94 C?#96 C?#97 C?#104-C?#107: ECCN_US/EU: n/a
C?#93 C?#98 C?#99 C?#102 C?#103 = Cap_4.7uF_X5R_10%_0603: Capacitor,4.7uF,16V, X5R,10%,0603,YAGEO; Manuf_Part_1: CC0603KRX5R7BB475; Order: CC0603KRX5R7BB105; Revision: July-2002: Re-released for DXP Platform.; Value: 4.7uF; Manuf_1: YAGEO; ECCN_US/EU: n/a
C?#95 C?#100 C?#101 C?#108 C?#109 = Cap_1uF_X5R_10%_0603: Capacitor,1uF,16V,X5R,10%,0603,YAGEO; Manuf_Part_1: CC0603KRX5R7BB105; Revision: July-2002: Re-released for DXP Platform.; Value: 1uF; Order: CC0603KRX5R7BB105; Manuf_1: YAGEO; ECCN_US/EU: n/a
C?#110-C?#112 = Cap_2.2uF_X5R_10%_0603: Capacitor,2.2uF,10V, X5R,10%,0603,YAGEO; Manuf_Part_1: CC0603KRX5R6BB225; Manuf_Part_2: C0603C225K8PACTU; Manuf_2: KEMET; Revision: July-2002: Re-released for DXP Platform.; Value: 2.2uF; Order: *; Manuf_1: YAGEO; ECCN_US/EU: n/a
C?#113 C?#114 = Cap_22nF_X7R_10%_0402: Capacitor,22nF,16V,X7R,10%,0402,YAGEO; Manuf_Part_1: CC0402KRX7R7BB223; Revision: July-2002: Re-released for DXP Platform.; Value: 22nF; Order: CC0402KRX7R7BB223; Manuf_1: YAGEO; ECCN_US/EU: n/a
CN?#9 = PJ3028B-3_GR: Connector Jack Stereo 3.5mm, female SMT, Green (Line output); Manuf_1: qiaod; Manuf_Part_2: PJ30280-3_GR; ECCN_US/EU: n/a; Manuf_Part_1: PJ3028B-3_GR
CN?#10 = PJ3028B-3_BE: Connector Jack Stereo 3.5mm, female SMT, Blue (Line input); Manuf_1: qiaod; Manuf_Part_2: PJ30280-3_BE; ECCN_US/EU: n/a; Manuf_Part_1: PJ3028B-3_BE
CN?#11 = RCA_SMD: RCA Phono Jack, Right Angle, SMD, Yellow; Manuf_Part_1: JBB0819100002; Manuf_1: Jiubaba
JP?#4 JP?#5 = Jumper2: Fitted: NO; ECCN_US/EU: n/a
R?#108 R?#116 = Res_NA_0402: Resistor,[NA],0402; Fitted: NO; Value: [NA]; ECCN_US/EU: n/a
R?#109 R?#111 = Res_0_5%_0402: Resistor,0,0402,5%,YAGEO; Manuf_Part_1: RC0402JR-070RL; Order: 2363467; Value: 0; ECCN_US/EU: n/a; Manuf_1: YAGEO; Distrib: FARNELL
R?#110 R?#112 = Res_10K_1%_0402: Resistor,10K,0402,1%,YAGEO; Manuf_Part_1: RC0402FR-0710KL; Value: 10K; Manuf_1: YAGEO; Order: RC0402FR-0710KL; ECCN_US/EU: n/a
R?#113 R?#114 = Res_20_1%_0402: Resistor,20,0402,1%,YAGEO; Manuf_Part_1: RC0402FR-0720RL; Value: 20; Manuf_1: YAGEO; Order: *; ECCN_US/EU: n/a
R?#115 R?#117 = Res_1M_1%_0402: Resistor,1M,0402,1%,YAGEO; Manuf_Part_1: RC0402FR-071ML; Value: 1M; Manuf_1: YAGEO; Order: RC0402FR-071ML; ECCN_US/EU: n/a
R?#118 R?#119 = Res_100_1%_0402: Resistor,100,0402,1%,YAGEO; Manuf_Part_1: RC0402FR-07100RL; Order: 9239111; Value: 100; Manuf_1: YAGEO; ECCN_US/EU: n/a; Distrib: FARNELL
R?#120 = Res_75_1%_0402: Resistor,75,0402,1%,YAGEO; Manuf_Part_1: RC0402FR-0775RL; Order: 311-75.0LRTR-ND; Value: 75; Manuf_1: YAGEO; ECCN_US/EU: n/a; Distrib: DIGIKEY
TP?#3 = TP1: Test Point; Fitted: NO; ECCN_US/EU: n/a
U?#16 = WM8994ECS/R: Multi-Channel Audio Hub CODEC for Smartphones; Manuf_1: Cirrus Logic; ECCN_US/EU: EAR99/NEC; Manuf_Part_1: WM8994ECS/R; Distrib: Cirrus Logic
U?#17 U?#18 = IMP34DT05TR: MEMS audio sensor omnidirectional digital microphone for industrial applications; Manuf_1: STMICROELECTRONICS; ECCN_US/EU: EAR99/NEC; provided: SUBCO with ST control; Manuf_Part_1: IMP34DT05TR; value: IMP34DT05TR
U?#19 U?#20 = 74LVC1G04SE: Single inverter gate with a standard push-pull output. (1.65V to 5.5V); Manuf_Part_1: 74LVC1G04SE-7; Manuf_1: DIODES; Order: 1845218; ECCN_US/EU: EAR99/NEC; Distrib: FARNELL

## Sheet [14] - IO SYSTEM.SchDoc
size A3; DocumentNumber: 14; SheetNumber: 14; SheetTotal: 18
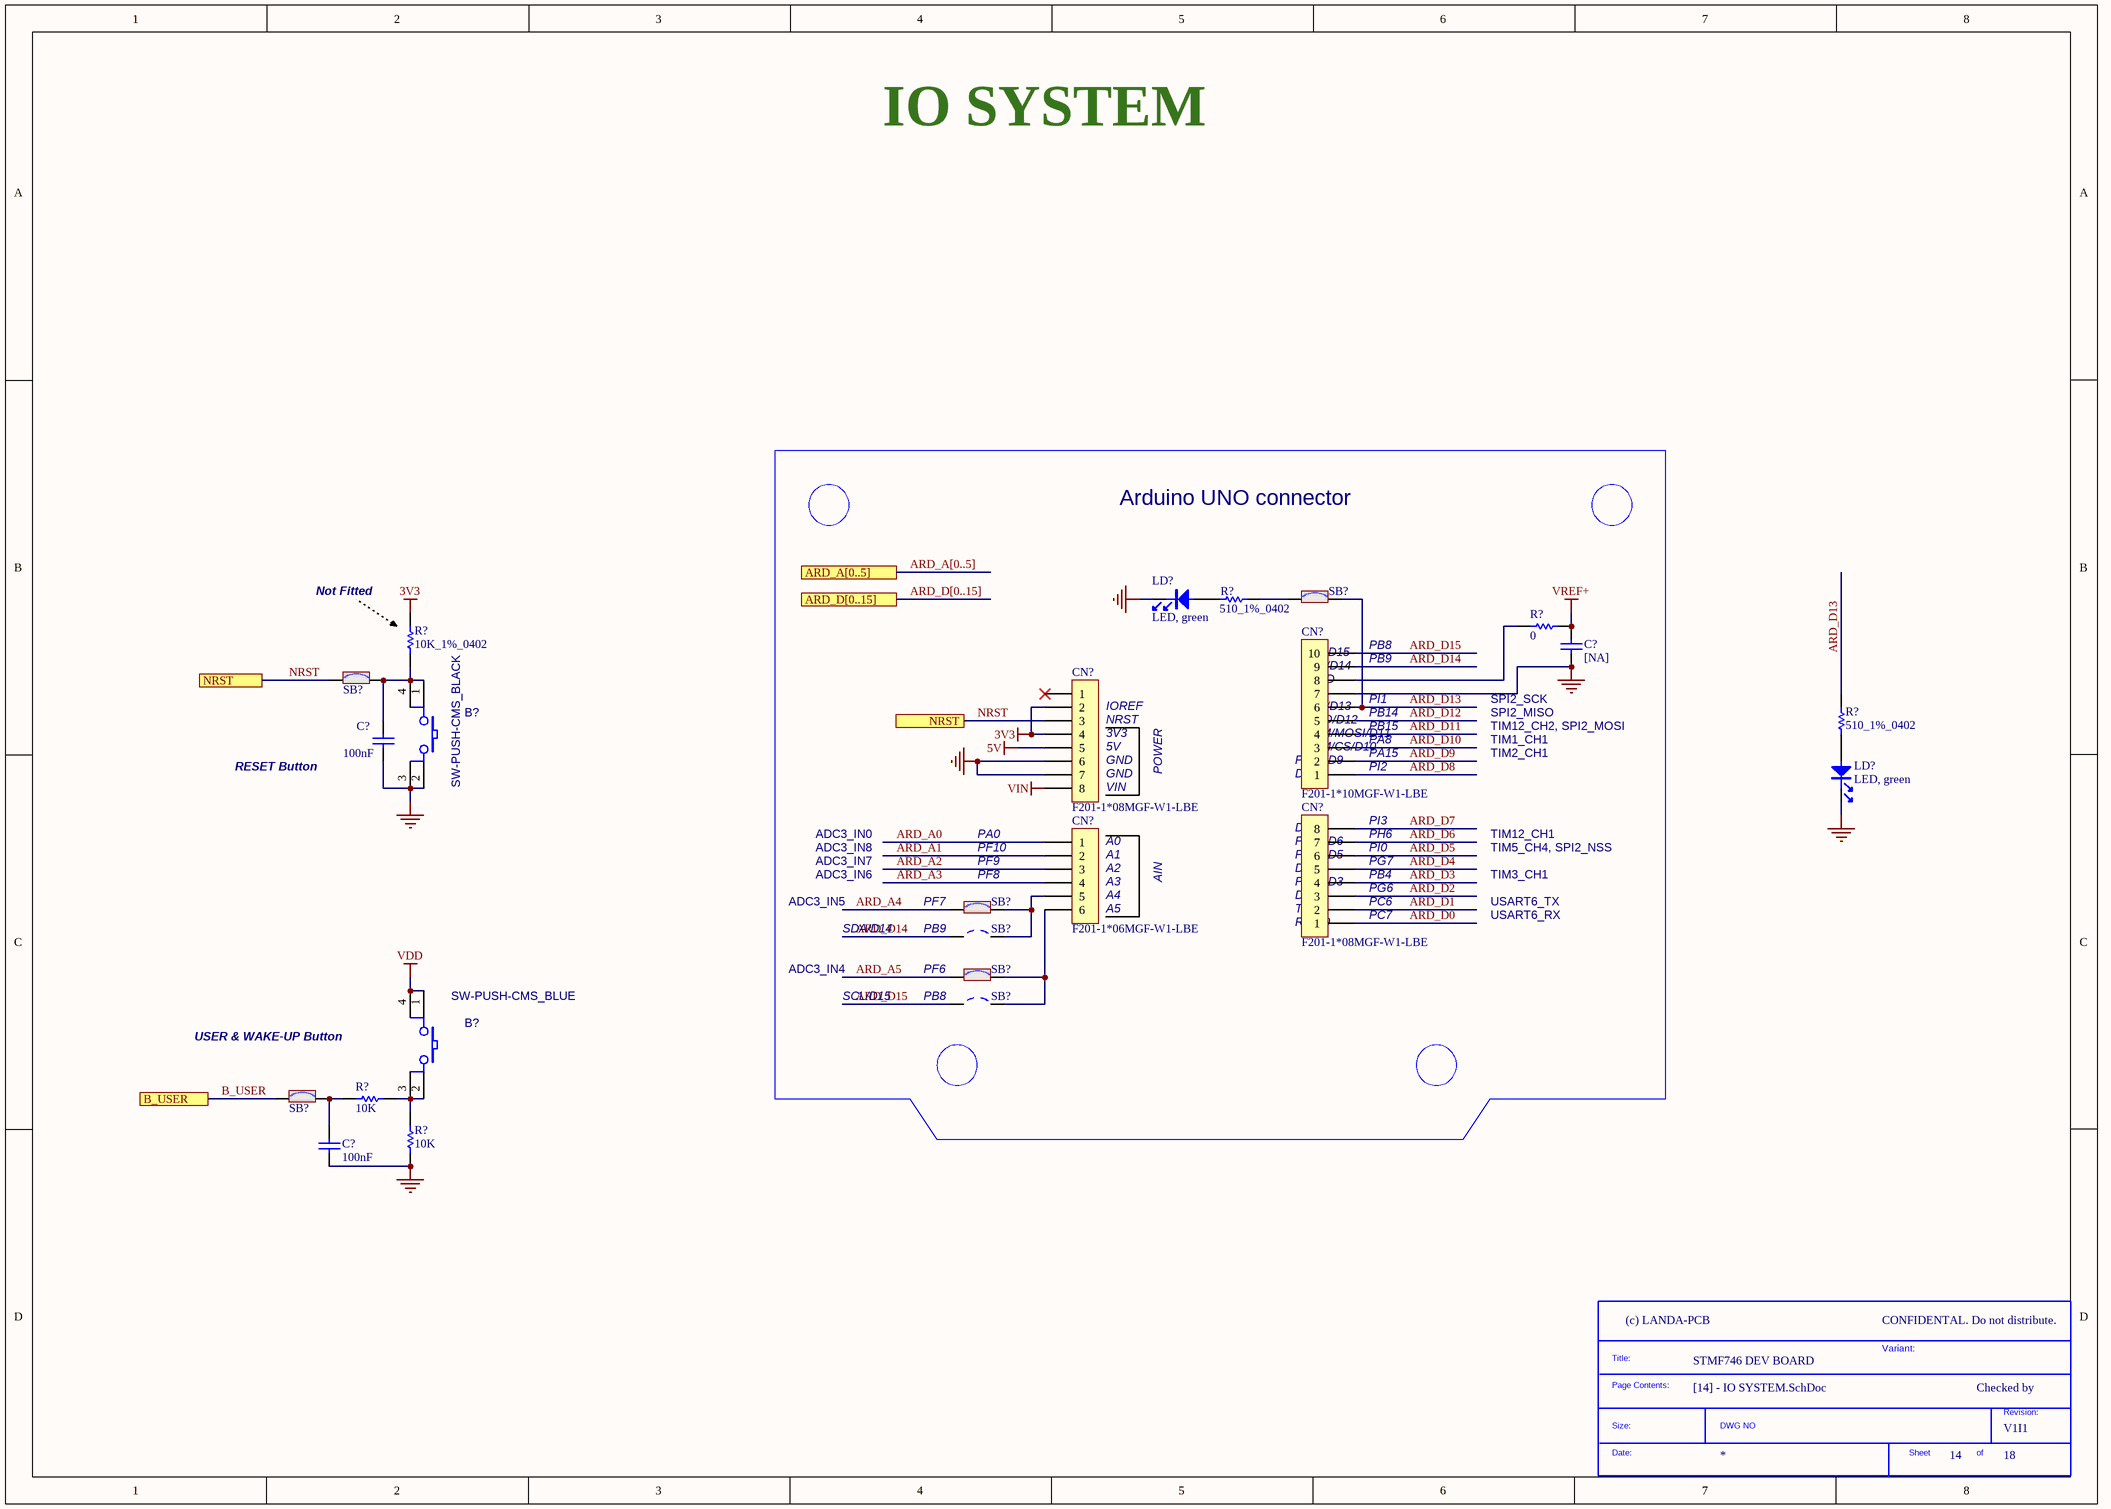
[diagram p16: [14] - IO SYSTEM.SchDoc]

### Parts
(Parts that share a designator on the sheet are numbered #1, #2 ... from top to bottom, then left to right.)
*#17  SDTitleBlock  (value not drawn)  (graphical)
B?#1  SW-PUSH-CMS_BLACK  [BP1CMS]
B?#2  SW-PUSH-CMS_BLUE  [BP1CMS]
C?#117  [NA]  [0402C]
C?#118  100nF  [0402C]
C?#119  100nF  [0402C]
CN?#12  F201-1*08MGF-W1-LBE  [F201-1*08MGF-W1-BA]
CN?#13  F201-1*10MGF-W1-LBE  [F201-1*10MGF-W1-BA]
CN?#14  F201-1*06MGF-W1-LBE  [F201-1*06MGF-W1-BA]
CN?#15  F201-1*08MGF-W1-LBE  [F201-1*08MGF-W1-BA]
LD?#5  LED, green  [0603D]
LD?#6  LED, green  [0603D]
R?#121  510_1%_0402  [0402R]
R?#122  0  [0402R]
R?#123  10K_1%_0402  [0402R]
R?#124  510_1%_0402  [0402R]
R?#125  10K  [0402R]
R?#126  10K  [0402R]
SB?#3  Solder Bridge ON  [JP2_SMD]  (value not drawn)
SB?#4  Solder Bridge ON  [JP2_SMD]  (value not drawn)
SB?#5  Solder Bridge ON  [JP2_SMD]  (value not drawn)
SB?#6  Solder Bridge OFF  [JP2_SMD]  (value not drawn)
SB?#7  Solder Bridge ON  [JP2_SMD]  (value not drawn)
SB?#8  Solder Bridge OFF  [JP2_SMD]  (value not drawn)
SB?#9  Solder Bridge ON  [JP2_SMD]  (value not drawn)

### Blocks framed on the sheet
Arduino UNO connector: C?#117 CN?#12-CN?#15 LD?#5 R?#121 R?#122 SB?#3 SB?#5-SB?#8

### Ports
ARD_A[0..5], ARD_D[0..15], B_USER, NRST

### Nets
3V3: CN?#12.2 CN?#12.4 R?#123.2  [project net 3V3_uSD]
5V: CN?#12.5
GND: B?#1.2 B?#1.3 C?#117.1 C?#118.1 C?#119.1 CN?#12.6 CN?#12.7 CN?#13.7 LD?#5.2 LD?#6.2 R?#126.1
VDD: B?#2.1 B?#2.4
VIN: CN?#12.8
VREF+: C?#117.2 R?#122.2
ARD_A0: CN?#14.1
ARD_A1: CN?#14.2
ARD_A2: CN?#14.3
ARD_A3: CN?#14.4
ARD_A4: SB?#5.1
ARD_A5: SB?#7.1
ARD_D0: CN?#15.1
ARD_D1: CN?#15.2
ARD_D2: CN?#15.3
ARD_D3: CN?#15.4
ARD_D4: CN?#15.5
ARD_D5: CN?#15.6
ARD_D6: CN?#15.7
ARD_D7: CN?#15.8
ARD_D8: CN?#13.1
ARD_D9: CN?#13.2
ARD_D10: CN?#13.3
ARD_D11: CN?#13.4
ARD_D12: CN?#13.5
ARD_D13: CN?#13.6 R?#124.2 SB?#3.2
ARD_D14: CN?#13.9 SB?#6.1
ARD_D15: CN?#13.10 SB?#8.1
B_USER: SB?#9.1 ; port B_USER
NRST: CN?#12.3 SB?#4.1 ; port NRST
NetB?#1_1: B?#1.1 B?#1.4 C?#118.2 R?#123.1 SB?#4.2
NetB?#2_2: B?#2.2 B?#2.3 R?#125.2 R?#126.2
NetC?#119_2: C?#119.2 R?#125.1 SB?#9.2
NetCN?#13_8: CN?#13.8 R?#122.1
NetCN?#14_5: CN?#14.5 SB?#5.2 SB?#6.2
NetCN?#14_6: CN?#14.6 SB?#7.2 SB?#8.2
NetLD?#5_1: LD?#5.1 R?#121.1
NetLD?#6_1: LD?#6.1 R?#124.1
NetR?#121_2: R?#121.2 SB?#3.1

Not connected (* = marked no-connect by the designer): CN?#12 1*

### Buses and harness runs
bus ARD_A[0..5] = port ARD_A[0..5]
bus ARD_D[0..15] = port ARD_D[0..15]

### Notes on the sheet
- IO SYSTEM
- (near R?#123) Not Fitted
- PB8
- (near CN?#12) IOREF
- (near CN?#12) NRST
- (near CN?#13) SDA/D14
- (near CN?#13) SCL/D15
- (near CN?#13) SCK/D13
- (near CN?#13) MISO/D12
- (near CN?#13) AVDD
- (near CN?#13) GND
- (near CN?#13) PB14
- (near CN?#13) PI1
- (near CN?#13) PB9
- SPI2_MISO
- SPI2_SCK
- RESET Button
- (near CN?#12) 3V3
- (near CN?#12) 5V
- (near CN?#12) GND
- POWER
- (near CN?#13) D8
- (near CN?#13) PWM/D9
- (near CN?#13) PWM/CS/D10
- (near CN?#13) PWM/MOSI/D11
- (near CN?#13) PI2
- (near CN?#13) PA15
- (near CN?#13) PA8
- (near CN?#13) PB15
- TIM2_CH1
- TIM1_CH1
- TIM12_CH2, SPI2_MOSI
- ADC3_IN8
- ADC3_IN0
- PA0
- PF10
- (near CN?#14) A0
- (near CN?#14) A1
- (near CN?#12) VIN
- (near CN?#15) PWM/D5
- (near CN?#15) PWM/D6
- (near CN?#15) D7
- (near CN?#15) PI0
- (near CN?#15) PH6
- (near CN?#15) PI3
- TIM5_CH4, SPI2_NSS
- TIM12_CH1
- ADC3_IN5
- ADC3_IN6
- ADC3_IN7
- (near SB?#5) PF7
- (near SB?#5) PF9
- (near SB?#5) PF8
- (near CN?#14) A2
- (near CN?#14) A3
- (near CN?#14) A4
- (near CN?#14) A5
- AIN
- (near CN?#15) TX/D1
- (near CN?#15) D2
- (near CN?#15) D4
- (near CN?#15) PWM/D3
- (near CN?#15) PC6
- (near CN?#15) PG6
- (near CN?#15) PB4
- (near CN?#15) PG7
- (near CN?#15) PC7
- USART6_RX
- USART6_TX
- TIM3_CH1
- ADC3_IN4
- SDA/D14
- (near SB?#7) PF6
- (near SB?#6) PB9
- (near CN?#15) RX/D0
- USER & WAKE-UP Button
- SCL/D15
- (near SB?#8) PB8
- CONFIDENTAL. Do not distribute.
- CLOCKS (CPU & PCIE)
- Variant:
- Checked by
- (in symbol SDTitleBlock) Title:; Page Contents:; Revision:; Size:; DWG NO; Date:; Sheet; of

### Library data of the parts
B?#1 = SW-PUSH-CMS_BLACK: Non-Open Push-Button 0.1A 24V; Manuf_2: FARNELL; Manuf_Part_2: 535-930; Manuf_1: wealthmetal; Manuf_Part_1: TD0341X-G01-BLA; Ref St: 9180120; Distrib: JFVNY; ECCN_US/EU: n/a
B?#2 = SW-PUSH-CMS_BLUE: Non-Open Push-Button 0.1A 24V; Manuf_2: FARNELL; Manuf_Part_2: 535-930; Manuf_1: wealthmetal; Manuf_Part_1: TD0341X-G01-BLU; Ref St: 9180120; Distrib: JFVNY; ECCN_US/EU: n/a
C?#117 = Cap_NA_0402: Capacitor,NA,0402; Fitted: NO; Revision: July-2002: Re-released for DXP Platform.; Value: [NA]; ECCN_US/EU: n/a
C?#118 C?#119 = Cap_100nF_X7R_10%_0402: as C?#92 on sheet [13] - AUDIO; Revision: July-2002: Re-released for DXP Platform.; Value: 100nF; Order: CC0402KRX7R7BB104; Manuf_1: YAGEO
CN?#12 CN?#15 = F201-1*08MGF-W1-BA: Header, 8-Pins, Single row, female SMD; Manuf_1: TOWNES; Manuf_Part_2: SSW-108-22-L-S-VS; Manuf_2: SAMTEC; Manuf_Part_1: F201-1*08MGF-W1-LBE; Distrib: Sub Co; ECCN_US/EU: n/a
CN?#13 = F201-1*10MGF-W1-BA: Header, 10-Pins, Single row, female SMD; Manuf_1: TOWNES; Manuf_Part_2: SSW-110-22-L-S-VS; Manuf_2: SAMTEC; Manuf_Part_1: F201-1*10MGF-W1-LBE; Distrib: Sub Co; ECCN_US/EU: n/a
CN?#14 = F201-1*06MGF-W1-BA: Header, 6-Pins, Single row, female SMD; Manuf_1: TOWNES; Manuf_Part_2: SSW-106-22-L-S-VS; Manuf_2: SAMTEC; Manuf_Part_1: F201-1*06MGF-W1-LBE; Distrib: Sub Co; ECCN_US/EU: n/a
LD?#5 LD?#6 = LED_green: LED, green, 0603; Manuf_1: everlight; Manuf_Part_1: 19-213SYGC/S530-E2/TR8; ECCN_US/EU: EAR99/NEC; Order: 19-213SYGC/S530-E2/TR8
R?#121 R?#124 = Res_510_1%_0402: Resistor,510,0402,1%,YAGEO; Manuf_Part_1: RC0402FR-07510L; Value: 510; Manuf_1: YAGEO; Order: RC0402FR-07510L; ECCN_US/EU: n/a; Distrib: DIGIKEY
R?#122 = Res_0_5%_0402: as R?#109 on sheet [13] - AUDIO; Value: 0; ECCN_US/EU: n/a; Manuf_1: YAGEO; Distrib: FARNELL
R?#123 = Res_10K_1%_0402: Resistor,10K,0402,1%,YAGEO; Manuf_Part_1: RC0402FR-0710KL; Fitted: NO; Value: 10K; Manuf_1: YAGEO; Order: RC0402FR-0710KL; ECCN_US/EU: n/a
R?#125 R?#126 = Res_10K_1%_0402: as R?#110 on sheet [13] - AUDIO; Value: 10K; Manuf_1: YAGEO; Order: RC0402FR-0710KL; ECCN_US/EU: n/a
SB?#3-SB?#5 SB?#7 SB?#9 = SB_ON: Solder: YES; Revision: July-2002: Re-released for DXP Platform.; ECCN_US/EU: n/a
SB?#6 SB?#8 = SB_OFF: Solder: NO; Revision: July-2002: Re-released for DXP Platform.; ECCN_US/EU: n/a

## Sheet [15] - POWER IN.SchDoc
size A3; DocumentNumber: 15; SheetNumber: 15; SheetTotal: 18
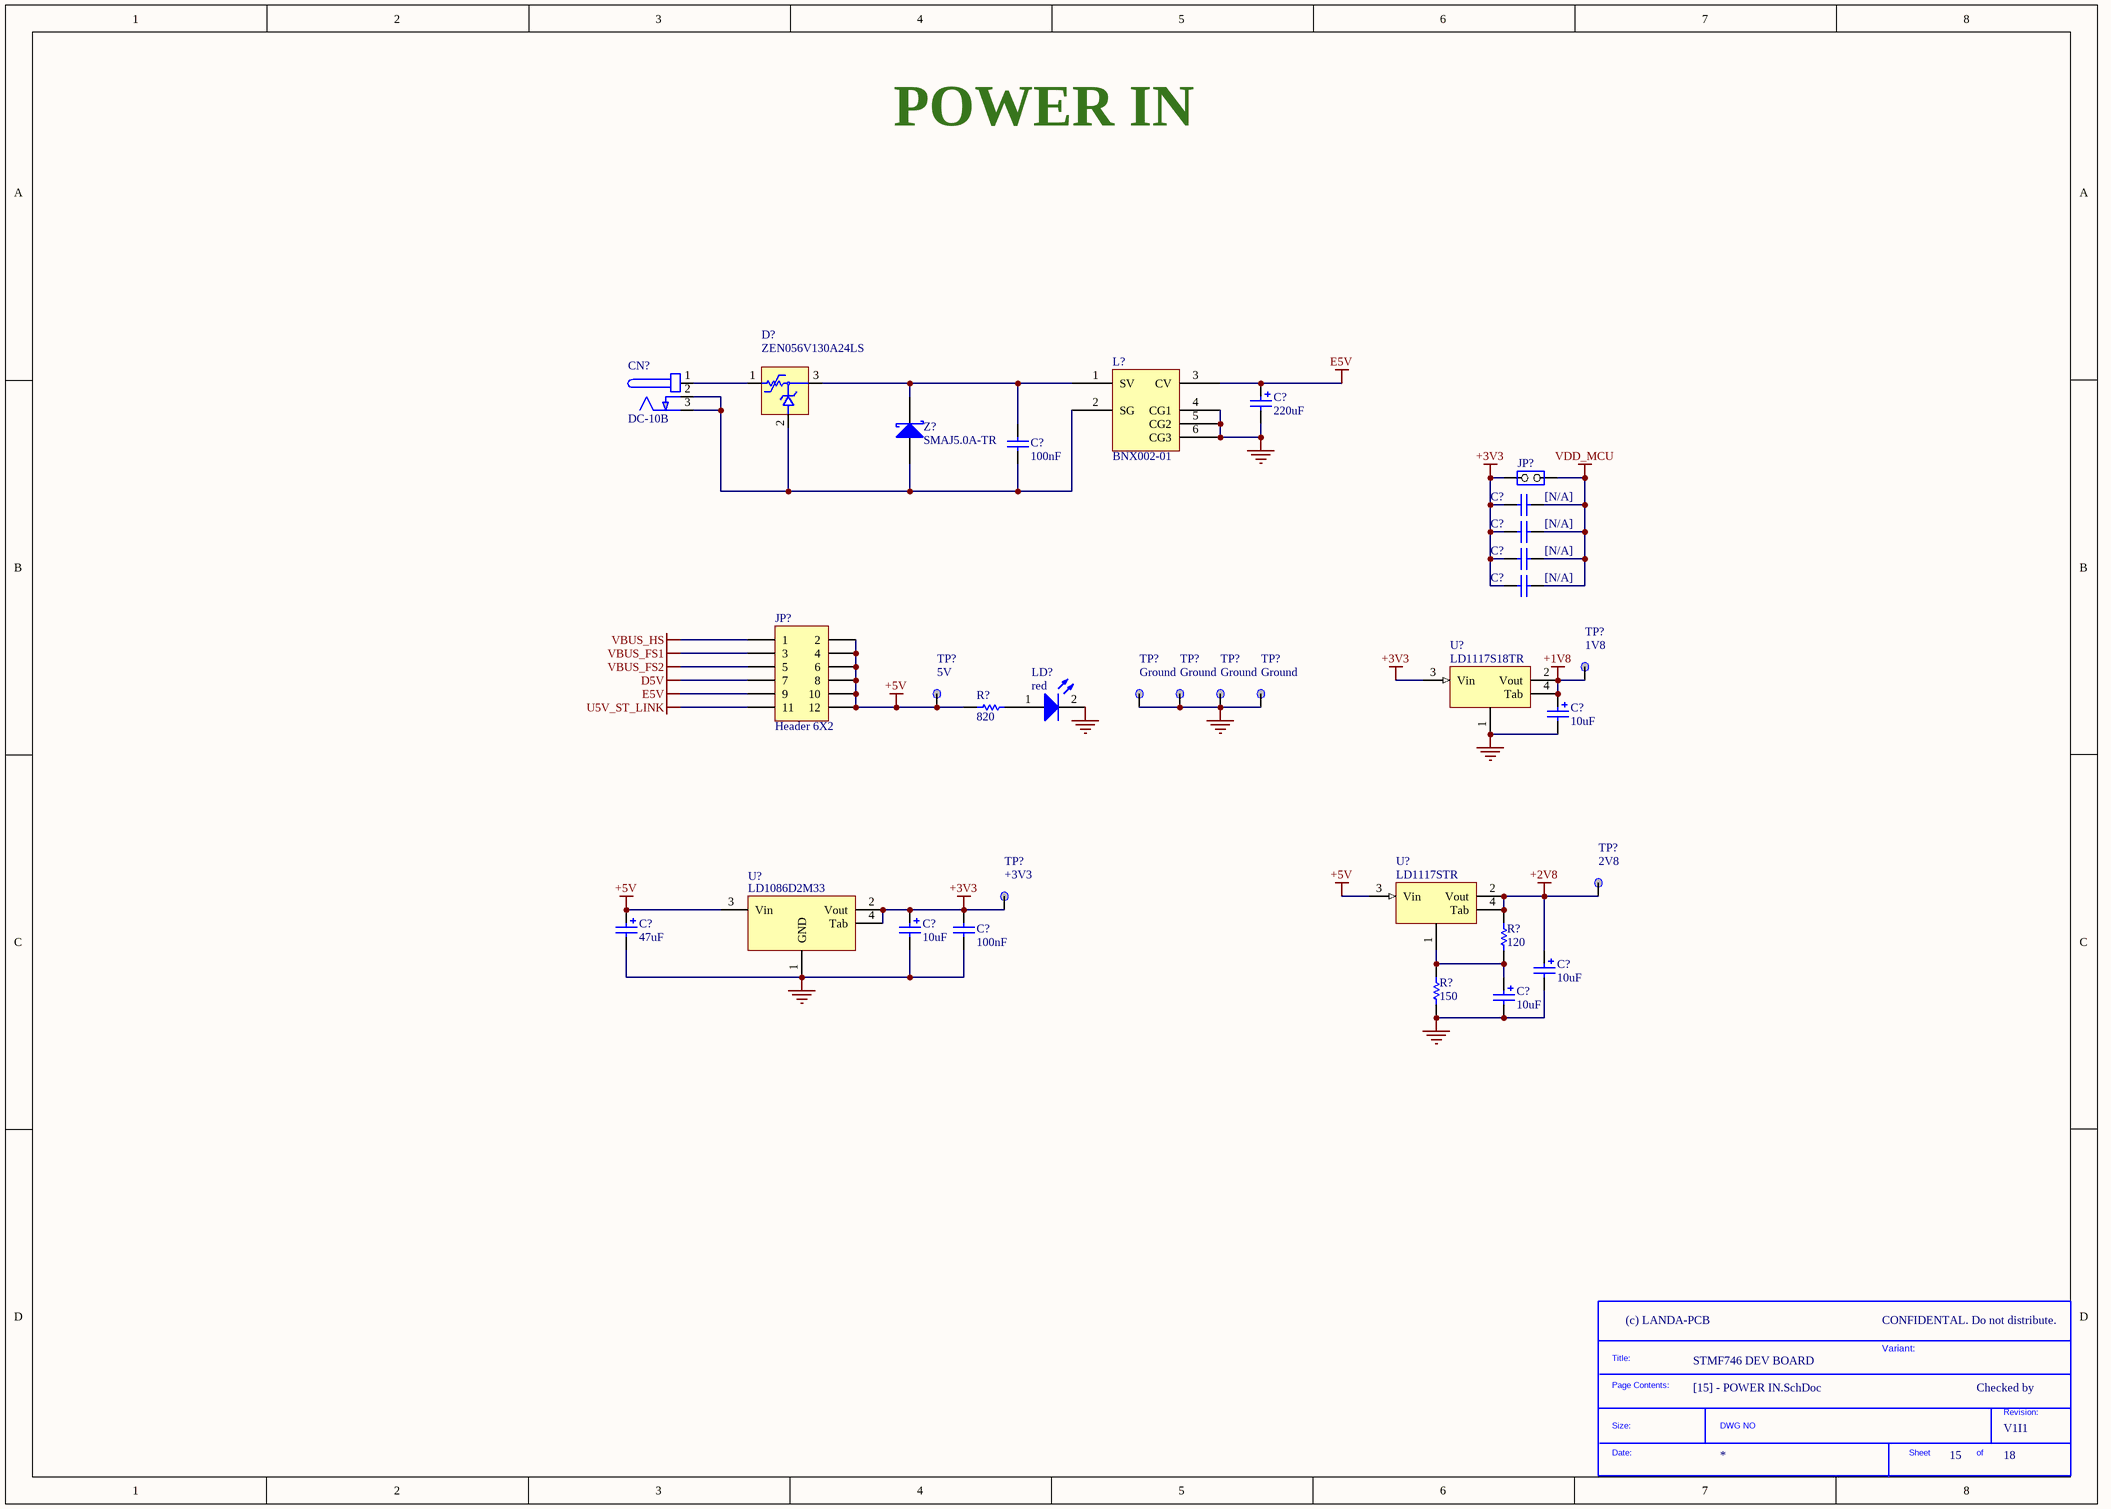
[diagram p17: [15] - POWER IN.SchDoc]

### Parts
(Parts that share a designator on the sheet are numbered #1, #2 ... from top to bottom, then left to right.)
*#18  SDTitleBlock  (value not drawn)  (graphical)
C?#120  220uF  [c310m-6]
C?#121  100nF  [0603C]
C?#122  [N/A]  [0603C]
C?#123  [N/A]  [0603C]
C?#124  [N/A]  [0603C]
C?#125  [N/A]  [0603C]
C?#126  10uF  [TAN-A]
C?#127  47uF  [CAE_5R3X5R3_H5R4]
C?#128  10uF  [TAN-A]
C?#129  100nF  [0603C]
C?#130  10uF  [TAN-A]
C?#131  10uF  [TAN-A]
CN?#16  DC-10B  [PWR_JACK_DC10]
D?#4  ZEN056V130A24LS  [TYCO_ZEN056V130A24LS]
JP?#6  (no value)  [SIP2]
JP?#7  Header 6X2  [HDR_2X6_2R54]
L?#8  BNX002-01  [BNX001]
LD?#7  red  [0603D]
R?#127  820  [0603R]
R?#128  120  [0603R]
R?#129  150  [0603R]
TP?#4  1V8  [TP]
TP?#5  5V  [TP]
TP?#6  Ground  [TP]
TP?#7  Ground  [TP]
TP?#8  Ground  [TP]
TP?#9  Ground  [TP]
TP?#10  2V8  [TP]
TP?#11  +3V3  [TP]
U?#21  LD1117S18TR  [SOT-223]
U?#22  LD1086D2M33  [TO263-3]
U?#23  LD1117STR  [SOT-223]
Z?  SMAJ5.0A-TR  [sma]

### Nets
+1V8: C?#126.1 TP?#4.1 U?#21.2(Vout) U?#21.4(Tab)
+2V8: C?#130.1 R?#128.1 TP?#10.1 U?#23.2(Vout) U?#23.4(Tab)
+3V3: C?#122.1 C?#123.1 C?#124.1 C?#125.1 C?#128.1 C?#129.1 JP?#6.1(COMMON) TP?#11.1 U?#21.3(Vin) U?#22.2(Vout) U?#22.4(Tab)
+5V: C?#127.1 JP?#7.2 JP?#7.4 JP?#7.6 JP?#7.8 JP?#7.10 JP?#7.12 R?#127.2 TP?#5.1 U?#22.3(Vin) U?#23.3(Vin)
D5V: JP?#7.7
E5V: C?#120.1 JP?#7.9 L?#8.3(CV)
GND: C?#120.2 C?#126.2 C?#127.2 C?#128.2 C?#129.2 C?#130.2 C?#131.2 L?#8.4(CG1) L?#8.5(CG2) L?#8.6(CG3) LD?#7.2(K) R?#129.2 TP?#6.1 TP?#7.1 TP?#8.1 TP?#9.1 U?#21.1 U?#22.1(GND)
U5V_ST_LINK: JP?#7.11
VBUS_FS1: JP?#7.3
VBUS_FS2: JP?#7.5
VBUS_HS: JP?#7.1
VDD_MCU: C?#122.2 C?#123.2 C?#124.2 C?#125.2 JP?#6.2(NO)
NetC?#121_1: C?#121.1 D?#4.3 L?#8.1(SV) Z?.2(K)
NetC?#121_2: C?#121.2 CN?#16.2(GND) CN?#16.3(GND) D?#4.2 L?#8.2(SG) Z?.1(A)
NetC?#131_1: C?#131.1 R?#128.2 R?#129.1 U?#23.1
NetCN?#16_1: CN?#16.1(+) D?#4.1
NetLD?#7_1: LD?#7.1(A) R?#127.1

### Notes on the sheet
- POWER IN
- CONFIDENTAL. Do not distribute.
- CLOCKS (CPU & PCIE)
- Variant:
- Checked by
- (in symbol SDTitleBlock) Title:; Page Contents:; Revision:; Size:; DWG NO; Date:; Sheet; of

### Library data of the parts
C?#120 = Cap Pol1: Polarized Capacitor (Radial); Value: 47uF; Published: 8-Jun-2000; Revision: July-2002: Re-released for DXP Platform.; Publisher: Altium Limited
C?#121 = CAP: Capacitor; Value: 100pF; Published: 8-Jun-2000; Revision: July-2002: Re-released for DXP Platform.; Publisher: Altium Limited
C?#122-C?#125 C?#129 = Cap: Capacitor; Value: 10nF; Published: 8-Jun-2000; Revision: July-2002: Re-released for DXP Platform.; Publisher: Altium Limited
C?#126 C?#128 C?#130 C?#131 = Cap Pol1: Polarized Capacitor (Radial); Published: 8-Jun-2000; Revision: July-2002: Re-released for DXP Platform.; Publisher: Altium Limited; Value: 10uF
C?#127 = Cap Pol1: Polarized Capacitor (Radial); Value: 10uF; Published: 8-Jun-2000; Revision: July-2002: Re-released for DXP Platform.; Publisher: Altium Limited
CN?#16 = PJ202A
JP?#6 = JP2
JP?#7 = Header 6X2: Header, 6-Pin, Dual row; Revision: 17-Jul-2002: Re-released for DXP Platform.; Publisher: Altium Limited
L?#8 = BNX002
LD?#7 = LED2: Typical RED, GREEN, YELLOW, AMBER GaAs LED; Published: 8-Jun-2000; Revision: July-2002: Re-released for DXP Platform.; Publisher: Altium Limited
R?#127-R?#129 = res1: Resistor; Value: 1K; Published: 8-Jun-2000; Revision: July-2002: Re-released for DXP Platform.; Publisher: Altium Limited
TP?#4-TP?#11 = TP
U?#21 U?#23 = LD1117
U?#22 = VOLTREG1
Z? = D Schottky: Schottky Diode; Code - JEDEC: DO-214-AA; Published: 8-Jun-2000; Revision: July-2002: Re-released for DXP Platform.; Publisher: Altium Limited

## Nets that join several sheets
1V8: [10] - USB (C?#77.2 U?#11.28 U?#11.30), [13] - AUDIO (6 pins)
3V3_uSD: [04] - SDRAM (28 pins), [05] - QSPI FLASH (C?#42.2 R?#21.2 U?#3.8), [06] - SD CARD (7 pins), [09] - ETHERNET (17 pins), [10] - USB (12 pins), [11] - LCD (5 pins), [13] - AUDIO (14 pins), [14] - IO SYSTEM (CN?#12.2 CN?#12.4 R?#123.2)
5V: [10] - USB (C?#75.1 U?#8.5 U?#10.5 U?#11.21), [14] - IO SYSTEM (CN?#12.5)
+3V3: [03] - MCU PWR & UNUSED (JP?#1.1), [16] - CTRL MOTOR (CN?#2.28 R?#29.2), [07] - JTAG (7 pins), [08] - RS232 (C?#58.1 U?#6.22 U?#6.26), [12] - CAN (C?#91.1 R?#104.2 R?#106.1 U?#15.3), [15] - POWER IN (11 pins)
+5V: [16] - CTRL MOTOR (CN?#2.25), [15] - POWER IN (11 pins)
GND: [03] - MCU PWR & UNUSED (49 pins), [04] - SDRAM (46 pins), [05] - QSPI FLASH (C?#42.1 U?#3.4), [06] - SD CARD (C?#43.2 CN?#1.6 CN?#1.9), [16] - CTRL MOTOR (27 pins), [07] - JTAG (15 pins), [08] - RS232 (8 pins), [09] - ETHERNET (23 pins), [10] - USB (29 pins), [11] - LCD (8 pins), [12] - CAN (10 pins), [13] - AUDIO (43 pins), [14] - IO SYSTEM (11 pins), [15] - POWER IN (18 pins)
VDD_MCU: [03] - MCU PWR & UNUSED (41 pins), [15] - POWER IN (5 pins)
VREF+: [03] - MCU PWR & UNUSED (5 pins), [14] - IO SYSTEM (C?#117.2 R?#122.2)
NRST: [09] - ETHERNET (U?#7.15), [10] - USB (U?#11.27), [14] - IO SYSTEM (CN?#12.3 SB?#4.1)